# Altium schematic sheet Q8_V2.2_Open_Source_Sch.SchDoc
size B; SheetNumber: 1; SheetTotal: 1
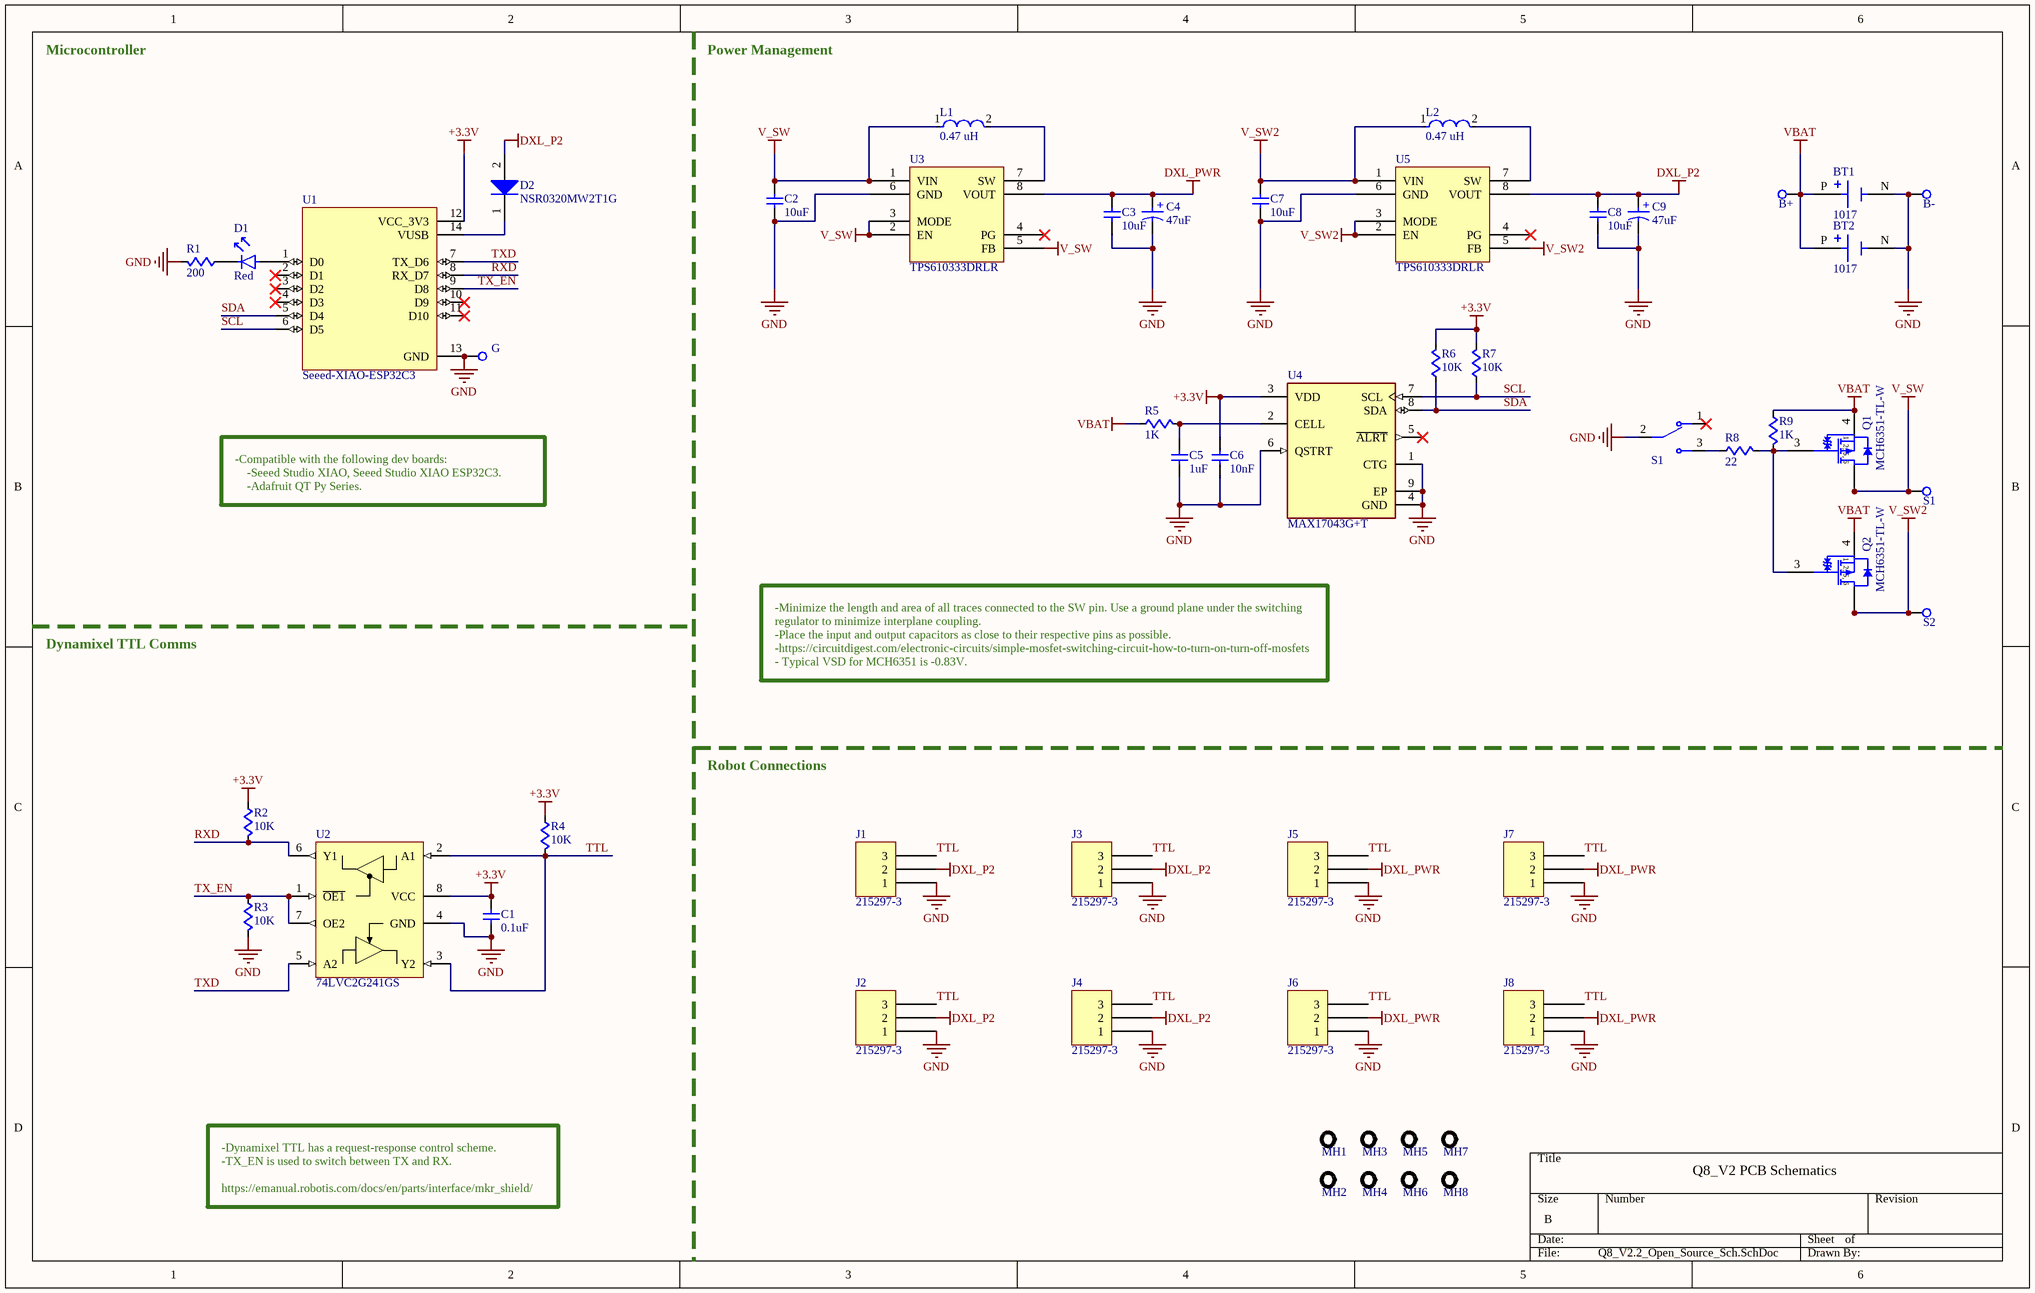
[diagram p0: Q8_V2.2_Open_Source_Sch.SchDoc]

## Parts
(Parts that share a designator on the sheet are numbered #1, #2 ... from top to bottom, then left to right.)
B+  Test_Point  [Test_Point_1.5mm]  (value not drawn)
B-  Test_Point  [Test_Point_1.5mm]  (value not drawn)
BT1  1017  [BAT_1017]
BT2  1017  [BAT_1017]
C1  0.1uF  [CAPC1608X90N]
C2  10uF  [CAPC2012X145N]
C3  10uF  [CAPC2012X145N]
C4  47uF  [WCAP-ASLI_D5H5.5]
C5  1uF  [CAPC1608X90N]
C6  value 10nF  [CAPC1608X90N]  (hidden comment: 1uF)
C7  10uF  [CAPC2012X145N]
C8  10uF  [CAPC2012X145N]
C9  47uF  [WCAP-ASLI_D5H5.5]
D1  value Red  [LED-LTST-C190KRKT]  (hidden comment: LTST-C190KRKT)
D2  NSR0320MW2T1G  [ONSC-SOD-323-2-477-02_V]
G  Test_Point  [Test_Point_1.5mm]  (value not drawn)
J1  215297-3  [TE_215297-3]
J2  215297-3  [TE_215297-3]
J3  215297-3  [TE_215297-3]
J4  215297-3  [TE_215297-3]
J5  215297-3  [TE_215297-3]
J6  215297-3  [TE_215297-3]
J7  215297-3  [TE_215297-3]
J8  215297-3  [TE_215297-3]
L1  0.47 uH  [FP-XGL4020-MFG]
L2  0.47 uH  [FP-XGL4020-MFG]
MH1  Mounting Hole  [Mounting Hole Non Plated M2 4mm Ring]  (value not drawn)  (no BOM)
MH2  Mounting Hole  [Mounting Hole Non Plated M2 4mm Ring]  (value not drawn)  (no BOM)
MH3  Mounting Hole  [Mounting Hole Non Plated M2 4mm Ring]  (value not drawn)  (no BOM)
MH4  Mounting Hole  [Mounting Hole Non Plated M2 4mm Ring]  (value not drawn)  (no BOM)
MH5  Mounting Hole  [Mounting Hole Non Plated M2 4mm Ring]  (value not drawn)  (no BOM)
MH6  Mounting Hole  [Mounting Hole Non Plated M2 4mm Ring]  (value not drawn)  (no BOM)
MH7  Mounting Hole  [Mounting Hole Non Plated M2 4mm Ring]  (value not drawn)  (no BOM)
MH8  Mounting Hole  [Mounting Hole Non Plated M2 4mm Ring]  (value not drawn)  (no BOM)
Q1  MCH6351-TL-W  [ONSC-MCPH-6_V]
Q2  MCH6351-TL-W  [ONSC-MCPH-6_V]
R1  200  [RESC1608X45N]
R2  10K  [RESC1608X45N]
R3  10K  [RESC1608X45N]
R4  10K  [RESC1608X45N]
R5  1K  [RESC1608X45N]
R6  10K  [RESC1608X45N]
R7  10K  [RESC1608X45N]
R8  22  [RESC1608X45N]
R9  1K  [RESC1608X45N]
S1#1  EG1215AA  [SW_EG1215AA]  (value not drawn)
S1#2  Test_Point  [Test_Point_1.5mm]  (value not drawn)
S2  Test_Point  [Test_Point_1.5mm]  (value not drawn)
U1  Seeed-XIAO-ESP32C3  [XIAO-ESP32C3-14P-2.54-21X17.8MM]
U2  74LVC2G241GS  [NXP_74LVC2G241GS]
U3  TPS610333DRLR  [SOTFL50P160X60-8N]
U4  MAX17043G+T  [FP-T823-1-MFG]
U5  TPS610333DRLR  [SOTFL50P160X60-8N]

## Nets
+3.3V: C1.2 C6.1 R2.1 R4.1 R6.2 R7.2 U1.12(VCC_3V3) U2.8(VCC) U4.3(VDD)
DXL_P2: C8.1 C9.1(P) D2.2(A) J1.2 J2.2 J3.2 J4.2 U5.8(VOUT)
DXL_PWR: C3.1 C4.1(P) J5.2 J6.2 J7.2 J8.2 U3.8(VOUT)
GND: B-.1 BT1.N(NEG) BT2.N(NEG) C1.1 C2.2 C3.2 C4.2(N) C5.2 C6.2 C7.2 C8.2 C9.2(N) G.1 J1.1 J2.1 J3.1 J4.1 J5.1 J6.1 J7.1 J8.1 R1.2 R3.2 S1#1.2 U1.13(GND) U2.4(GND) U3.6(GND) U4.1(CTG) U4.4(GND) U4.6(QSTRT) U4.9(EP) U5.6(GND)
V_SW: C2.1 L1.1 Q1.1(D) Q1.2(D) Q1.5(D) Q1.6(D) S1#2.1 U3.1(VIN) U3.2(EN) U3.3(MODE) U3.5(FB)
V_SW2: C7.1 L2.1 Q2.1(D) Q2.2(D) Q2.5(D) Q2.6(D) S2.1 U5.1(VIN) U5.2(EN) U5.3(MODE) U5.5(FB)
VBAT: B+.1 BT1.P(POS) BT2.P(POS) Q1.4(S) Q2.4(S) R5.1 R9.1
RXD: R2.2 U1.8(RX_D7) U2.6(Y1)
SCL: R7.1 U1.6(D5) U4.7(SCL)
SDA: R6.1 U1.5(D4) U4.8(SDA)
TTL: J1.3 J2.3 J3.3 J4.3 J5.3 J6.3 J7.3 J8.3 R4.2 U2.2(A1) U2.3(Y2)
TX_EN: R3.1 U1.9(D8) U2.1(~{OE1}) U2.7(OE2)
TXD: U1.7(TX_D6) U2.5(A2)
NetC5_1: C5.1 R5.2 U4.2(CELL)
NetD1_1: D1.1(C) R1.1
NetD1_2: D1.2(A) U1.1(D0)
NetD2_1: D2.1(K) U1.14(VUSB)
NetL1_2: L1.2 U3.7(SW)
NetL2_2: L2.2 U5.7(SW)
NetQ1_3: Q1.3(G) Q2.3(G) R8.2 R9.2
NetR8_1: R8.1 S1#1.3

Not connected (* = marked no-connect by the designer): S1#1 1*; U1 2(D1)* 3(D2)* 4(D3)* 10(D9)* 11(D10)*; U3 4(PG)*; U4 5(~{ALRT})*; U5 4(PG)*

## Notes on the sheet
- Microcontroller
- Power Management
- -Compatible with the following dev boards:
  -Seeed Studio XIAO, Seeed Studio XIAO ESP32C3.
  -Adafruit QT Py Series.
- Dynamixel TTL Comms
- -Minimize the length and area of all traces connected to the SW pin. Use a ground plane under the switching regulator to minimize interplane coupling.
  -Place the input and output capacitors as close to their respective pins as possible.
  -https://circuitdigest.com/electronic-circuits/simple-mosfet-switching-circuit-how-to-turn-on-turn-off-mosfets
  - Typical VSD for MCH6351 is -0.83V.
- Robot Connections
- Q8_V2 PCB Schematics
- -Dynamixel TTL has a request-response control scheme.
  -TX_EN is used to switch between TX and RX.
  https://emanual.robotis.com/docs/en/parts/interface/mkr_shield/
- (in symbol CMP-1058-00608-1) 1, 2, 5, 6
- (in symbol CMP-03913-53914570-1) +

## Library data of the parts
B+ B- G S1#2 S2 = 30099: Test Point Generic; ID: 30099; Sorted_Value: 0
C1 = 30006: CAP CER 0.1uF ±10% 25V X7R 0603 (1608 Metric); ID: 30006; Sorted_Value: 1E-6; Value: 0.1uF
C2 C3 C7 C8 = 30012: CAP CER 10uF ±10% 25V X7R 0805 (2012 Metric); ID: 30012; Sorted_Value: 1E-5; Value: 10uF
C4 C9 = CMP-03913-53914570-1: 865080342006 WCAP-ASLI Aluminum Electrolytic Capacitors; ESR (Equivalent Series Resistance): 832.685mΩ; Impedance: 1.05Ω; Voltage Rating: 16V; Leakage Current: 7.52µA; Ripple Current: 195mA; Polarity: Polar; Insulation Resistance: 2.12766MΩ; Capacitance: 47µF; Tolerance: 20%; Life (Hours): 2000hours; Min Operating Temperature: -55°C; Case/Package: Radial; Height: 5.5mm; Height - Seated (Max): 5.5118mm; Diameter: 5mm; Width: 5.3mm; Voltage Rating (DC): 16V; Max Operating Temperature: 105°C; Ripple Current (AC): 195mA; Mount: Surface Mount; RoHS: Compliant; Packaging: Tape & Reel (TR); REACH SVHC: Unknown; NexarPartId: 53914570; Length: 5.5mm
C5 = 30006: CAP CER 1uF ±10% 25V X7R 0603 (1608 Metric); ID: 30006; Sorted_Value: 1E-6; Value: 1uF
C6 = 30006: CAP CER 10nF ±10% 25V X7R 0603 (1608 Metric); ID: 30006; Sorted_Value: 1E-6
D1 = 30031: LED CLEAR CHIP SMD RED; ID: 30031; Sorted_Value: 0
D2 = CMP-1055-00466-1: Schottky Barrier Diode, 2-Pin SOD-323, Pb-Free, Tape and Reel; Manufacturer: On Semiconductor; Configuration: Single; IFSM Max (A): 5; Mounting Technology: Surface Mount; Packing: Tape and Reel; PackageDescription: 2-Pin SOD, Body 1.7 x 1.25 mm; ComponentLink3Description: Package Specification; PartNumber: NSR0320MW2T1G; ComponentLink1URL: http://www.onsemi.com/; PackageReference: SOD-323-2-477-02; RoHS: TRUE; PackageVersion: Rev. H, 03/2007; DatasheetVersion: Rev. 4; ComponentLink1Description: Manufacturer URL; ComponentLink3URL: http://www.onsemi.com/pub_link/Collateral/477-02.PDF.1; ComponentLink2Description: Datasheet; ComponentLink2URL: http://www.onsemi.cn/pub_link/Collateral/NSR0320MW2T1-D.PDF
L1 L2 = CMP-11268-000025-1: Shielded Power Inductors / XGL4020-471MEC; Manufacturer: Coilcraft; Tolerance: 20%; Standoff Height: 0.19mm; Rms Current: 19.7A; Saturation Current: 6.1A; Shielding: true; Self Resonant Frequency: 95MHz; Inductance: 0.47uH; Core Material: Composite; Series Resistance: 5.1mΩ; Test Frequency: 1MHz; Value: 0.47uH; Automotive Grade: Grade 1; Device Class L2: Inductors; Device Class L3: Fixed Inductors; ComponentLink2URL: https://www.coilcraft.com/pdfs/xgl4020.pdf; Composition: Wirewound; RoHS: TRUE; Category: Ind; Octopart: https://octopart.com/xgl4020-471mec-coilcraft-99681030; Ambient Temperature Range High: +125°C; Manufacturer Part Number: XGL4020-471MEC; Package: XGL4020; Device Class L1: Passive Components; Automotive: Yes; Height: 2.1mm; Ambient Temperature Range Low: -40°C; ComponentLink2Description: Datasheet; Lead Free: Yes
MH1-MH8 = Mounting Hole: Mounting hole, no connection
Q1 Q2 = CMP-1058-00608-1: P-Channel Power MOSFET -12 V, -9 A, 16.9 mOhm, Single, 6-Pin MCPH, Pb-Free, Tape and Reel; Manufacturer: On Semiconductor; Ciss Typ (pF): 2200; VGS(th) Max (V): 1.3; ID Max (A): 9; PD Max (W): 1.5; Channel Polarity: P Channel; VGS Max (V): 10; Crss Typ (pF): 320; V(BR)DSS Min (V): 12; Coss Typ (pF): 350; PartNumber: MCH6351-TL-W; Package Type: SC-88FL / MCPH-6; PackageDescription: 6-Pin Small Outline Transistor, Body 2 x 1.6 mm, Pitch 0.65 mm; Configuration: Single; ComponentLink2Description: Datasheet; ComponentLink1Description: Manufacturer URL; RoHS: Pb-Free; ComponentLink1URL: http://www.onsemi.com/; ComponentLink2URL: http://www.onsemi.com/pub_link/Collateral/ENA2198-D.PDF; ComponentLink3URL: http://www.onsemi.com/pub_link/Collateral/ENA1601-D.PDF; PackageReference: MCPH-6; Packing: Tape and Reel; ComponentLink3Description: Package Specification; Mounting Technology: Surface Mount
R1 R5 R9 = 30002: RES 1K Ohm ±1% 1/10W 0603 (1608 Metric); ID: 30002; Sorted_Value: 1000
  R1: Value: 200
  R5 R9: Value: 1K
R2-R4 R6 R7 = 30002: RES 10K Ohm ±1% 1/10W 0603 (1608 Metric); ID: 30002; Sorted_Value: 1000; Value: 10K
R8 = 30002: RES 22 Ohm ±1% 1/10W 0603 (1608 Metric); ID: 30002; Sorted_Value: 1000; Value: 22
S1#1 = 30023: SWITCH SLIDE SPDT 25mA 24V; MF: E-Switch; Value: 0; ID: 30023; Check_prices: https://www.snapeda.com/parts/EG1215AA/E-Switch/view-part/?ref=eda; SnapEDA_Link: https://www.snapeda.com/parts/EG1215AA/E-Switch/view-part/?ref=snap; Purchase-URL: https://pricing.snapeda.com/search/part/EG1215AA/?ref=eda; Package: None; MP: EG1215AA; Sorted_Value: 0
U1 = Seeed-XIAO-ESP32C3: - ESP32-C3 Transceiver; 802.11 a/b/g/n (Wi-Fi, WiFi, WLAN), BluetoothÂ® Smart 4.x Low Energy (BLE) 2.4GHz Evaluation Board; MP: 113991054; MF: Seeed Technology Co., Ltd; Price: None; Availability: In Stock; Package: None; Check_prices: https://www.snapeda.com/parts/113991054/Seeed+Technology+Co.%252C+Ltd/view-part/?ref=eda; Value: *; SnapEDA_Link: https://www.snapeda.com/parts/113991054/Seeed+Technology+Co.%252C+Ltd/view-part/?ref=snap; Purchase-URL: https://pricing.snapeda.com/search/part/113991054/?ref=eda
U2 = 30024: IC BUFFER NON-INVERT 5.5V 8XSON; MP: 74LVC2G08GT,115; MF: Nexperia; ID: 30024; Sorted_Value: 0; Availability: Good; Value: *; DigiKey-Purchase-URL: https://snapeda.com/shop?store=DigiKey&id=1232762; Package: XSON-8 Nexperia; Price: None; SnapEDA_Link: https://www.snapeda.com/parts/74LVC2G08GT,115/Nexperia/view-part/1232762/?ref=snap; Mouser-Purchase-URL: https://snapeda.com/shop?store=Mouser&id=1232762; Arrow_Electronics-Purchase-URL: https://snapeda.com/shop?store=Arrow+Electronics&id=1232762; Arrow_Europe-Purchase-URL: https://snapeda.com/shop?store=Arrow+Europe&id=1232762
U3 U5 = TPS610333DRLR: IC REG BOOST ADJ 5A SOT583
U4 = CMP-05715-000066-1: IC 2-WIRE FG MODEL GAUGE LO BATT; Manufacturer: Maxim; Max Supply Voltage: 4.5V; Standoff Height: 0mm; Nominal Supply Current: 50uA; Min Supply Voltage: 2.5V; Number Of Cells: 1; Height: 0.8mm; Device Class L3: Battery Management; Package: T823-1; Footprint Url: https://pdfserv.maximintegrated.com/land_patterns/90-0091.PDF; ComponentLink2Description: Datasheet; Lead Free: Yes; RoHS: TRUE; Mouser Description: Battery Management Over Volt Protector Ideal Diode; Digikey Description: IC 2-WIRE FG MODEL GAUGE LO BATT; Device Class L1: Integrated Circuits (ICs); Manufacturer Part Number: MAX17043G+T; Temperature: -20°C to +70°C; Automotive: No; ComponentLink2URL: https://datasheets.maximintegrated.com/en/ds/MAX17043-MAX17044.pdf; Device Class L2: Power Management ICs; Octopart: https://octopart.com/max17043g%2Bt-maxim+integrated-43979038; Category: IC; Temperature Range High: +70°C; Temperature Range Low: -20°C
BT1 BT2 = 1017: Value: *; Package: None; MP: 1017; Price: None; Availability: Unavailable